# Altium schematic sheet ALU.schdoc
size 236 x 119 mm
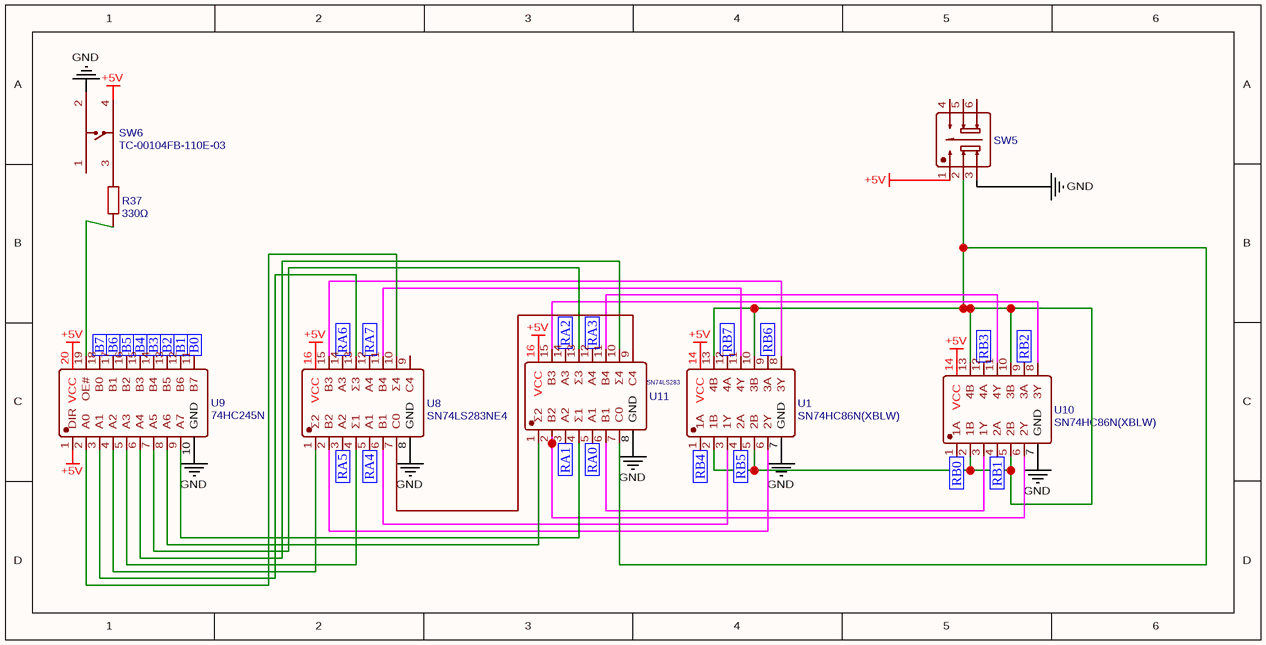
[diagram p0: ALU.schdoc]

## Parts
R37  330Ω  [RES-TH_BD3.3-L9.0-P13.00-D0.6]
SW5  XKB8585-Z-190  [SW-TH_6P-L8.6-W8.6-P2.50-LS5.4]  (value not drawn)
SW6  TC-00104FB-110E-03  [SW-TH_4P-L6.0-W6.0-P4.50-LS6.5]
U1  SN74HC86N(XBLW)  [DIP-14_L19.1-W6.4-P2.54-LS7.6-BL]
U8  SN74LS283NE4  [PDIP-16_L19.3-W6.4-P2.54-LS7.9-BL]
U9  74HC245N  [DIP-20_L26.8-W6.4-P2.54-LS7.6-BL]
U10  SN74HC86N(XBLW)  [DIP-14_L19.1-W6.4-P2.54-LS7.6-BL]
U11  SN74LS283  [PDIP-16_L19.3-W6.4-P2.54-LS7.9-BL]

## Ports
B0 (in), B1 (in), B2 (in), B3 (in), B4 (in), B5 (in), B6 (in), B7 (in), RA0 (in), RA1 (in), RA2 (in), RA3 (in), RA4 (in), RA5 (in), RA6 (in), RA7 (in), RB0 (in), RB1 (in), RB2 (in), RB3 (in), RB4 (in), RB5 (in), RB6 (in), RB7 (in)

## Nets
+5V: SW5.1 U1.14(VCC) U8.16(VCC) U9.1(DIR) U9.20(VCC) U10.14(VCC) U11.16(VCC)
GND: SW5.3 SW6.2 U1.7(GND) U8.8(GND) U9.10(GND) U10.7(GND) U11.8(GND)
B0: U9.11(B7) ; port B0
B1: U9.12(B6) ; port B1
B2: U9.13(B5) ; port B2
B3: U9.14(B4) ; port B3
B4: U9.15(B3) ; port B4
B5: U9.16(B2) ; port B5
B6: U9.17(B1) ; port B6
B7: U9.18(B0) ; port B7
RA0: U11.5(A1) ; port RA0
RA1: U11.3(A2) ; port RA1
RA2: U11.14(A3) ; port RA2
RA3: U11.12(A4) ; port RA3
RA4: U8.5(A1) ; port RA4
RA5: U8.3(A2) ; port RA5
RA6: U8.14(A3) ; port RA6
RA7: U8.12(A4) ; port RA7
RB0: U10.1(1A) ; port RB0
RB1: U10.4(2A) ; port RB1
RB2: U10.9(3A) ; port RB2
RB3: U10.12(4A) ; port RB3
RB4: U1.1(1A) ; port RB4
RB5: U1.4(2A) ; port RB5
RB6: U1.9(3A) ; port RB6
RB7: U1.12(4A) ; port RB7
NetR37_1: R37.1 U9.19(OE#)
NetR37_2: R37.2 SW6.3
NetSW5_2: SW5.2 U1.2(1B) U1.5(2B) U1.10(3B) U1.13(4B) U10.2(1B) U10.5(2B) U10.10(3B) U10.13(4B) U11.7(C0)
NetU1_3: U1.3(1Y) U8.6(B1)
NetU1_6: U1.6(2Y) U8.2(B2)
NetU1_8: U1.8(3Y) U8.15(B3)
NetU1_11: U1.11(4Y) U8.11(B4)
NetU8_1: U8.1(Σ2) U9.4(A2)
NetU8_4: U8.4(Σ1) U9.5(A3)
NetU8_7: U8.7(C0) U11.9(C4)
NetU8_10: U8.10(Σ4) U9.2(A0)
NetU8_13: U8.13(Σ3) U9.3(A1)
NetU9_6: U9.6(A4) U11.10(Σ4)
NetU9_7: U9.7(A5) U11.13(Σ3)
NetU9_8: U9.8(A6) U11.1(Σ2)
NetU9_9: U9.9(A7) U11.4(Σ1)
NetU10_3: U10.3(1Y) U11.6(B1)
NetU10_6: U10.6(2Y) U11.2(B2)
NetU10_8: U10.8(3Y) U11.15(B3)
NetU10_11: U10.11(4Y) U11.11(B4)

Not connected (* = marked no-connect by the designer): SW5 4 5 6; SW6 1 4; U8 9(C4)

## Notes on the sheet
- Labels drawn without touching a wire or pin: +5V

## Library data of the parts
R37 = 330Ω: Manufacturer: CCO(千志电子); Manufacturer Part: MF1/2W-0.1Ω±1% T; nameAlias: Value; Contributor: LCSC; Supplier: LCSC; Supplier Part: C119393; JLCPCB Part Class: Extended Part; spicePre: R; spiceSymbolName: MF1/2W-0.1Ω±1% T52
SW5 = XKB8585-Z-190: Manufacturer: XKB Connectivity(中国星坤); Contributor: LCSC; Supplier: LCSC; Supplier Part: C318849; Manufacturer Part: XKB8585-Z-190; JLCPCB Part Class: Extended Part; spicePre: S; spiceSymbolName: XKB8585-Z-190
SW6 = TC-00104FB-110E-03: Manufacturer: HOOYA(皓宇电子); Contributor: lcsc; Supplier: LCSC; Supplier Part: C7542981; Manufacturer Part: TC-00104FB-110E-03; JLCPCB Part Class: Extended Part; spicePre: S; spiceSymbolName: TC-00104FB-110E-03
U1 U10 = SN74HC86N(XBLW): Manufacturer: XBLW(芯伯乐); Contributor: lcsc; Supplier: LCSC; Supplier Part: C18723533; Manufacturer Part: SN74HC86N(XBLW); JLCPCB Part Class: Extended Part; spicePre: U; spiceSymbolName: SN74HC86N(XBLW)
U8 = SN74LS283NE4: Manufacturer: TI(德州仪器); Contributor: lcsc; Supplier: LCSC; Supplier Part: C20345767; Manufacturer Part: SN74LS283NE4; JLCPCB Part Class: Extended Part; spicePre: U; spiceSymbolName: SN74LS283NE4
U9 = 74HC245N: Manufacturer: HGSEMI(华冠); Contributor: LCSC; Supplier: LCSC; Supplier Part: C507182; Manufacturer Part: 74HC245N; JLCPCB Part Class: Extended Part; spicePre: U; spiceSymbolName: 74HC245N
U11 = SN74LS283: Manufacturer: TI(德州仪器); Manufacturer Part: SN74LS283NE4; Contributor: lcsc; Supplier: LCSC; Supplier Part: C20345767; JLCPCB Part Class: Extended Part; spicePre: U; spiceSymbolName: SN74LS283NE4